# Altium schematic sheet conn_inout.SchDoc
size A3
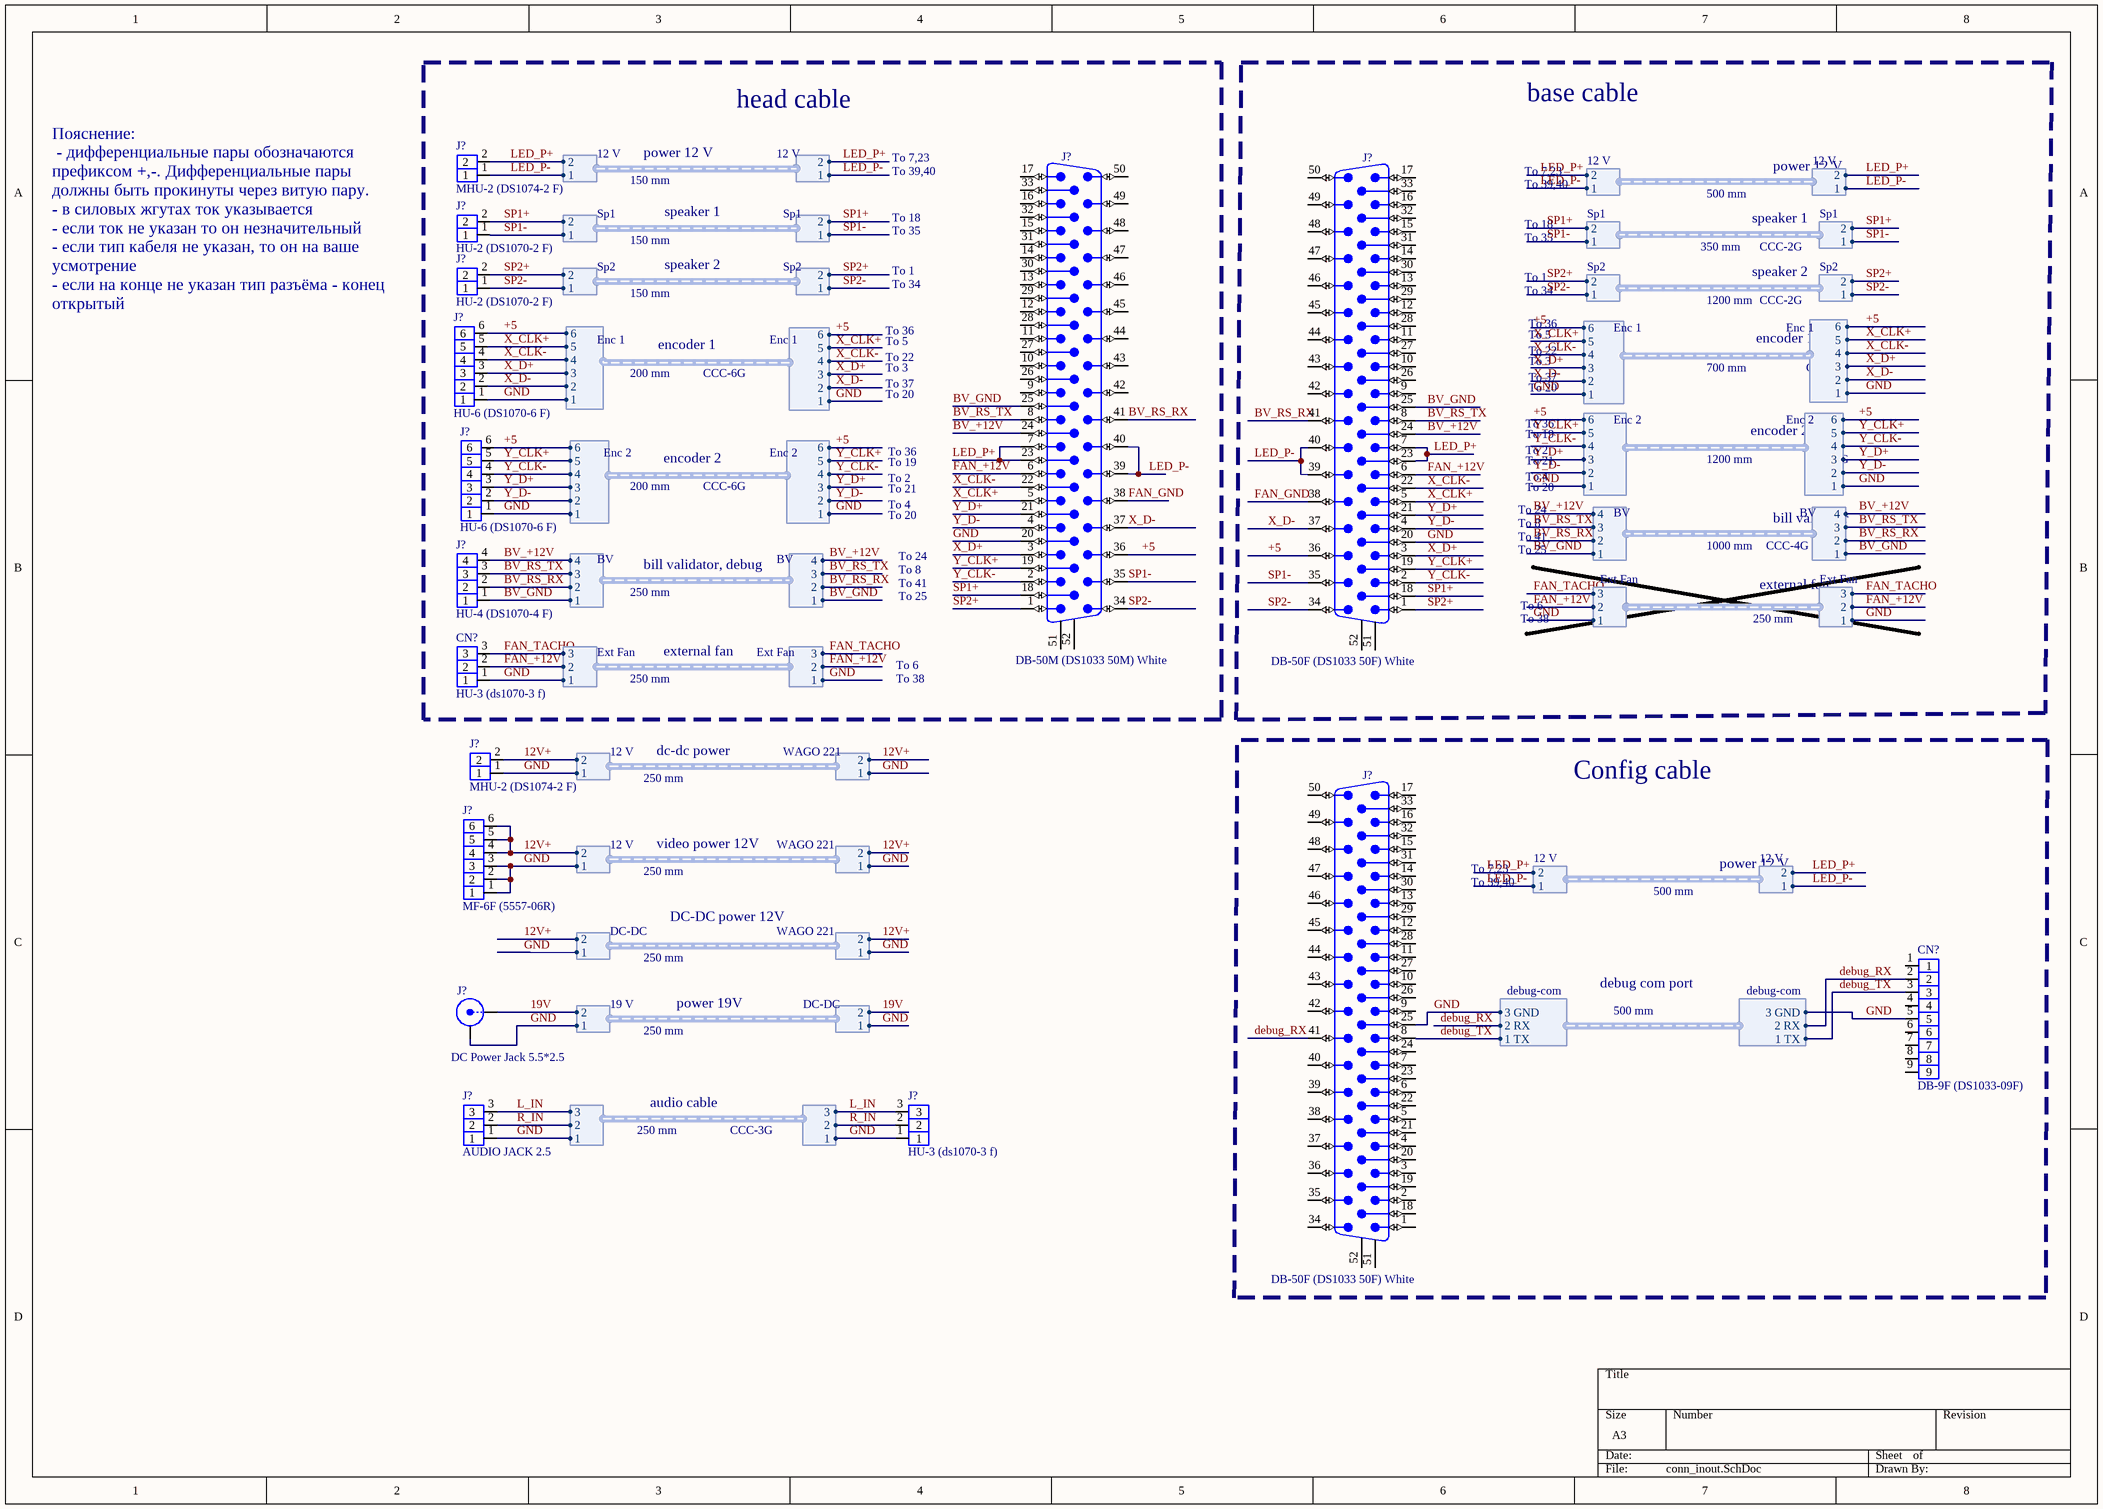
[diagram p0: conn_inout.SchDoc]

## Parts
(Parts that share a designator on the sheet are numbered #1, #2 ... from top to bottom, then left to right.)
CN?#1  HU-3 (ds1070-3 f)
CN?#2  DB-9F (DS1033-09F)
J?#1  MHU-2 (DS1074-2 F)
J?#2  DB-50M (DS1033 50M) White  [FCI_D50P24A4GV00LF]
J?#3  DB-50F (DS1033 50F) White  [FCI_D50P24A4GV00LF]
J?#4  HU-2 (DS1070-2 F)
J?#5  HU-2 (DS1070-2 F)
J?#6  HU-6 (DS1070-6 F)
J?#7  HU-6 (DS1070-6 F)
J?#8  HU-4 (DS1070-4 F)
J?#9  MHU-2 (DS1074-2 F)
J?#10  DB-50F (DS1033 50F) White  [FCI_D50P24A4GV00LF]
J?#11  MF-6F (5557-06R)
J?#12  DC Power Jack 5.5*2.5  [BNC_RA CON]
J?#13  AUDIO JACK 2.5
J?#14  HU-3 (ds1070-3 f)

## Blocks framed on the sheet
head cable: CN?#1 J?#1 J?#2 J?#4-J?#8
base cable: J?#3
Config cable: CN?#2 J?#10

## Harnesses
Enc 2: 1, 2, 3, 4, 5, 6
Enc 1: 1, 2, 3, 4, 5, 6
12 V: 1, 2
BV: 1, 2, 3, 4
Sp1: 1, 2
Sp2: 1, 2
Ext Fan: 1, 2, 3
debug-com: 1 TX, 2 RX, 3 GND
WAGO 221: 1, 2
?: 1, 2, 3
19 V: 1, 2
DC-DC: 1, 2

## Nets
12V+: J?#9.2 J?#11.4 J?#11.5 J?#11.6 ; harness 12 V.2, harness WAGO 221.2, harness DC-DC.2
19V: J?#12.1(X) ; harness 19 V.2, harness DC-DC.2
+5: J?#2.36 J?#3.36 J?#6.6 J?#7.6 ; harness Enc 2.6, harness Enc 1.6
BV_+12V: J?#2.24 J?#3.24 J?#8.4 ; harness BV.4
BV_GND: J?#2.25 J?#3.25 J?#8.1 ; harness BV.1
BV_RS_RX: J?#2.41 J?#3.41 J?#8.2 ; harness BV.2
BV_RS_TX: J?#2.8 J?#3.8 J?#8.3 ; harness BV.3
debug_RX: CN?#2.2 J?#10.41 ; harness debug-com.2 RX
debug_TX: CN?#2.3 J?#10.8 ; harness debug-com.1 TX
FAN_+12V: CN?#1.2 J?#2.6 J?#3.6 ; harness Ext Fan.2
FAN_GND: J?#2.38 J?#3.38
FAN_TACHO: CN?#1.3 ; harness Ext Fan.3
GND: CN?#1.1 CN?#2.5 J?#2.20 J?#3.20 J?#6.1 J?#7.1 J?#9.1 J?#10.25 J?#11.1 J?#11.2 J?#11.3 J?#12.2(Y) J?#13.1 J?#14.1 ; harness Enc 2.1, harness Enc 1.1, harness Ext Fan.1, harness debug-com.3 GND, harness 12 V.1, harness WAGO 221.1, harness ?.1, harness 19 V.1, harness DC-DC.1
L_IN: J?#13.3 J?#14.3 ; harness ?.3
LED_P+: J?#1.2 J?#2.7 J?#2.23 J?#3.7 J?#3.23 ; harness 12 V.2
LED_P-: J?#1.1 J?#2.39 J?#2.40 J?#3.39 J?#3.40 ; harness 12 V.1
R_IN: J?#13.2 J?#14.2 ; harness ?.2
SP1+: J?#2.18 J?#3.18 J?#4.2 ; harness Sp1.2
SP1-: J?#2.35 J?#3.35 J?#4.1 ; harness Sp1.1
SP2+: J?#2.1 J?#3.1 J?#5.2 ; harness Sp2.2
SP2-: J?#2.34 J?#3.34 J?#5.1 ; harness Sp2.1
X_CLK+: J?#2.5 J?#3.5 J?#6.5 ; harness Enc 1.5
X_CLK-: J?#2.22 J?#3.22 J?#6.4 ; harness Enc 1.4
X_D+: J?#2.3 J?#3.3 J?#6.3 ; harness Enc 1.3
X_D-: J?#2.37 J?#3.37 J?#6.2 ; harness Enc 1.2
Y_CLK+: J?#2.19 J?#3.19 J?#7.5 ; harness Enc 2.5
Y_CLK-: J?#2.2 J?#3.2 J?#7.4 ; harness Enc 2.4
Y_D+: J?#2.21 J?#3.21 J?#7.3 ; harness Enc 2.3
Y_D-: J?#2.4 J?#3.4 J?#7.2 ; harness Enc 2.2

Not connected (* = marked no-connect by the designer): CN?#2 1 4 6 7 8 9; J?#2 9 10 11 12 13 14 15 16 17 26 27 28 29 30 31 32 33 42 43 44 45 46 47 48 49 50 51 52; J?#3 9 10 11 12 13 14 15 16 17 26 27 28 29 30 31 32 33 42 43 44 45 46 47 48 49 50 51 52; J?#10 1 2 3 4 5 6 7 9 10 11 12 13 14 15 16 17 18 19 20 21 22 23 24 26 27 28 29 30 31 32 33 34 35 36 37 38 39 40 42 43 44 45 46 47 48 49 50 51 52

## Notes on the sheet
- power 12 V
- To 39,40
- To 7,23
- 150 mm
- speaker 1
- To 18
- To 35
- 350 mm
- 500 mm
- CCC-2G
- speaker 2
- To 1
- To 34
- 1200 mm
- 200 mm
- encoder 1
- CCC-6G
- To 5
- To 3
- To 36
- To 22
- To 37
- 700 mm
- Пояснение:
  - дифференциальные пары обозначаются префиксом +,-. Дифференциальные пары должны быть прокинуты через витую пару.
  - в силовых жгутах ток указывается
  - если ток не указан то он незначительный
  - если тип кабеля не указан, то он на ваше усмотрение
  - если на конце не указан тип разъёма - конец открытый
- To 20
- To 19
- encoder 2
- To 21
- To 4
- To 2
- To 24
- bill validator, debug
- To 8
- To 41
- To 25
- 1000 mm
- CCC-4G
- bill validator
- 250 mm
- external fan
- To 6
- To 38
- dc-dc power
- video power 12V
- DC-DC power 12V
- (near J?#10) To 39,40
- (near J?#10) To 7,23
- debug com port
- power 19V
- audio cable
- CCC-3G

## Library data of the parts
CN?#1 J?#13 J?#14 = 3-pin
CN?#2 = 9-pin
J?#1 J?#4 J?#5 J?#9 = 2-pin
J?#2 J?#3 J?#10 = FCI_D50P24A4GV00LF: Connector D-sub 50 Male; Part Description: Straight D-SUB 50 Male Contacts for PCB  with Harpoons and Female Screwlock (UNC4-40) and Elec. Continuity; Manufacturer: FCI; Part Number: FCI_D50P24A4GV00LF; Component Kind: Standard; Component Type: Standard; Pin Count: 50; Family: D-Sub 50M; Mounted: Yes; Socket: No; SMD: No; Status: None; Manufacturer Part Number: D50P24A4GV00LF; ComponentHeight: 12.3mm; HelpURL: \\cern.ch\dfs\Applications\Altium\Datasheets\FCI_D50P24A4GV00LF.pdf; ComponentLink1URL: Catalogue; ComponentLink1Description: \\cern.ch\dfs\Applications\Altium\Datasheets\FCI_D50P24A4GV00LF_Catalogue.pdf; Author: CERN DEM JLC; CreateDate: 11.08.2011; LatestRevisionDate: 11.08.2011; Table: FCI
J?#6 J?#7 J?#11 = 6-pin
J?#8 = 4-pin
J?#12 = BNC: BNC Elbow Connector; LatestRevisionDate: 17-Jul-2002; LatestRevisionNote: Re-released for DXP Platform.; Publisher: Altium Limited